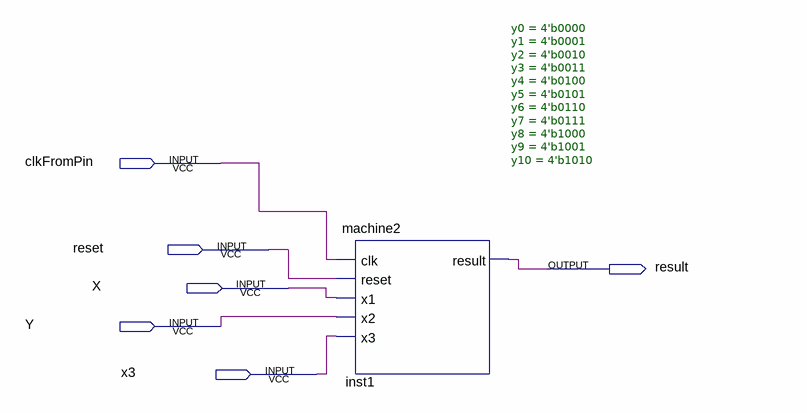
[diagram p0: schematic sheet]
// Quartus schematic Block1.bdf as structural Verilog: 1 symbols, 6 pins
module Block1 (
  input  clkFromPin,
  input  reset,
  input  X,
  input  Y,
  input  x3,
  output result
);

  machine2 #(.y0(4'b0000), .y1(4'b0001), .y2(4'b0010), .y3(4'b0011), .y4(4'b0100), .y5(4'b0101), .y6(4'b0110), .y7(4'b0111), .y8(4'b1000), .y9(4'b1001), .y10(4'b1010)) inst1 (
    .clk(clkFromPin), .reset(reset), .x1(X), .x2(Y), .x3(x3), .result(result));
endmodule
